# EAGLE design PWS (EAGLE 7.6.0)
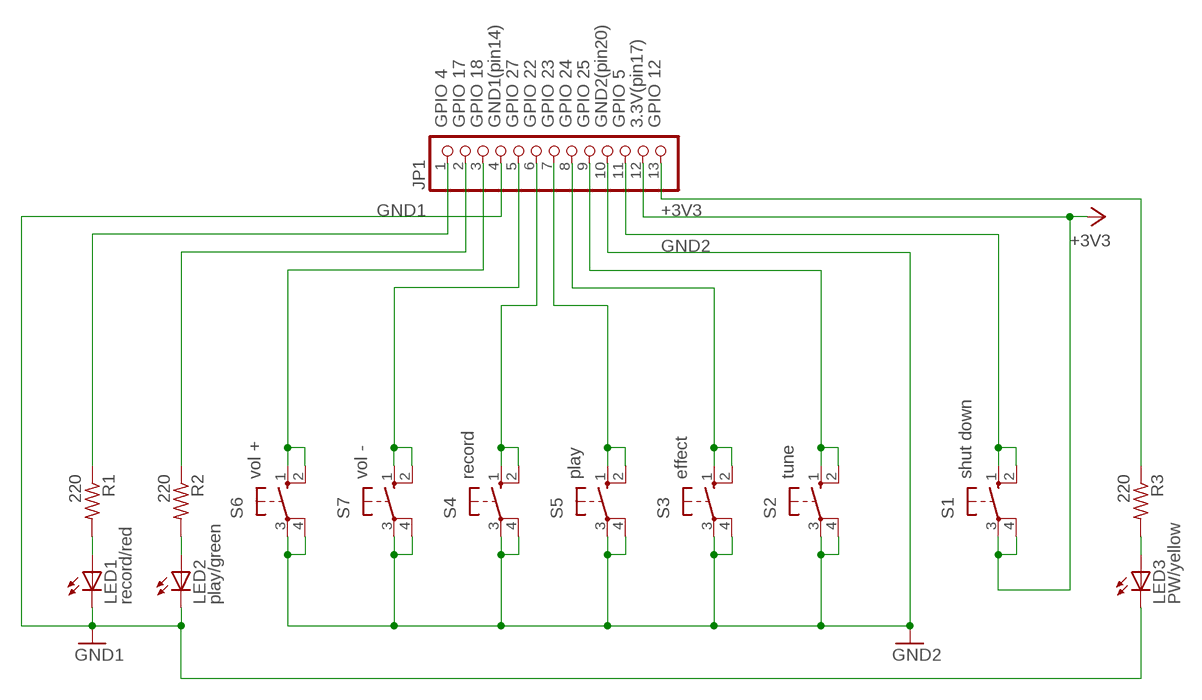
[diagram p0: schematic, sheet 1]

## Parts
JP1  PINHD-1X13  [1X13]
LED1  record/red  LED3MM  [LED3MM]
LED2  play/green  LED3MM  [LED3MM]
LED3  PW/yellow  LED3MM  [LED3MM]
R1  220  R-US_0204/5  [0204/5]
R2  220  R-US_0204/5  [0204/5]
R3  220  R-US_0204/5  [0204/5]
S1  shut down  10-XX  [B3F-10XX]
S2  tune  10-XX  [B3F-10XX]
S3  effect  10-XX  [B3F-10XX]
S4  record  10-XX  [B3F-10XX]
S5  play  10-XX  [B3F-10XX]
S6  vol +  10-XX  [B3F-10XX]
S7  vol -  10-XX  [B3F-10XX]

## Nets
+3V3: JP1.12 S1.3(P) S1.4(P1)
GND1: JP1.4 LED1.K(C) LED2.K(C) LED3.K(C)
GND2: JP1.10 S2.3(P) S2.4(P1) S3.3(P) S3.4(P1) S4.3(P) S4.4(P1) S5.3(P) S5.4(P1) S6.3(P) S6.4(P1) S7.3(P) S7.4(P1)
N$1: LED1.A R1.2
N$2: LED2.A R2.2
N$3: LED3.A R3.2
N$4: JP1.5 S7.1(S) S7.2(S1)
N$6: JP1.3 S6.1(S) S6.2(S1)
N$8: JP1.8 S3.1(S) S3.2(S1)
N$9: JP1.7 S5.1(S) S5.2(S1)
N$10: JP1.9 S2.1(S) S2.2(S1)
N$12: JP1.11 S1.1(S) S1.2(S1)
N$14: JP1.13 R3.1
N$15: JP1.6 S4.1(S) S4.2(S1)
N$16: JP1.2 R2.1
N$17: JP1.1 R1.1

## Notes on the sheet
- GPIO 4 | GPIO 17 | GPIO 18 | GND1(pin14) | GPIO 27 | GPIO 22 | GPIO 23 | GPIO 24 | GPIO 25 | GND2(pin20) | GPIO 5 | 3.3V(pin17) | GPIO 12

## Library data of the parts
JP1 = pinhead:PINHD-1X13: PIN HEADER
LED1-LED3 = led:LED: LED OSRAM: - CHIPLED LG R971, LG N971, LY N971, LG Q971, LY Q971, LO R971, LY R971 LH N974, LH R974 LS Q976, LO Q976, LY Q976 LO Q996 - Hyper CHIPLED LW Q18S LB Q993, LB Q99A, LB R99A - SideLED LS A670, LO A670, LY A670, LG A670, LP A670 LB A673, LV A673, LT A673, LW A673 LH A674 LY A675 LS A676, LA A676, LO A676, LY A676, LW A676 LS A679, LY A679, LG A679 - Hyper Micro SIDELED® LS Y876, LA Y876, LO Y876, LY Y876 LT Y87S - SmartLED LW L88C, LW L88S LB L89C, LB L89S, LG L890 LS L89K, LO L89K, LY L89K LS L896, LA L896, LO L896, LY L896 - TOPLED LS T670, LO T670, LY T670, LG T670, LP T670 LSG T670, LSP T670, LSY T670, LOP T670, LYG T670 LG T671, LOG T671, LSG T671 LB T673, LV T673, LT T673, LW T673 LH T674 LS T676, LA T676, LO T676, LY T676, LB T676, LH T676, LSB T676, LW T676 LB T67C, LV T67C, LT T67C, LS T67K, LO T67K, LY T67K, LW E67C LS E67B, LA E67B, LO E67B, LY E67B, LB E67C, LV E67C, LT E67C LW T67C LS T679, LY T679, LG T679 LS T770, LO T770, LY T770, LG T770, LP T770 LB T773, LV T773, LT T773, LW T773 LH T774 LS E675, LA E675, LY E675, LS T675 LS T776, LA T776, LO T776, LY T776, LB T776 LHGB T686 LT T68C, LB T68C - Hyper Mini TOPLED® LB M676 - Mini TOPLED Santana® LG M470 LS M47K, LO M47K, LY M47K Source: http://www.osram.convergy.de LUXEON: - LUMILED® LXK2-PW12-R00, LXK2-PW12-S00, LXK2-PW14-U00, LXK2-PW14-V00 LXK2-PM12-R00, LXK2-PM12-S00, LXK2-PM14-U00 LXK2-PE12-Q00, LXK2-PE12-R00, LXK2-PE12-S00, LXK2-PE14-T00, LXK2-PE14-U00 LXK2-PB12-K00, LXK2-PB12-L00, LXK2-PB12-M00, LXK2-PB14-N00, LXK2-PB14-P00, LXK2-PB14-Q00 LXK2-PR12-L00, LXK2-PR12-M00, LXK2-PR14-Q00, LXK2-PR14-R00 LXK2-PD12-Q00, LXK2-PD12-R00, LXK2-PD12-S00 LXK2-PH12-R00, LXK2-PH12-S00 LXK2-PL12-P00, LXK2-PL12-Q00, LXK2-PL12-R00 Source: www.luxeon.com KINGBRIGHT: KA-3528ASYC Source: www.kingbright.com
R1-R3 = resistor:R-US_: RESISTOR, American symbol
S1-S7 = switch-omron:10-XX: OMRON SWITCH; MPN: B3F-1000; OC_FARNELL: 176432; OC_NEWARK: 36M3542

## Board
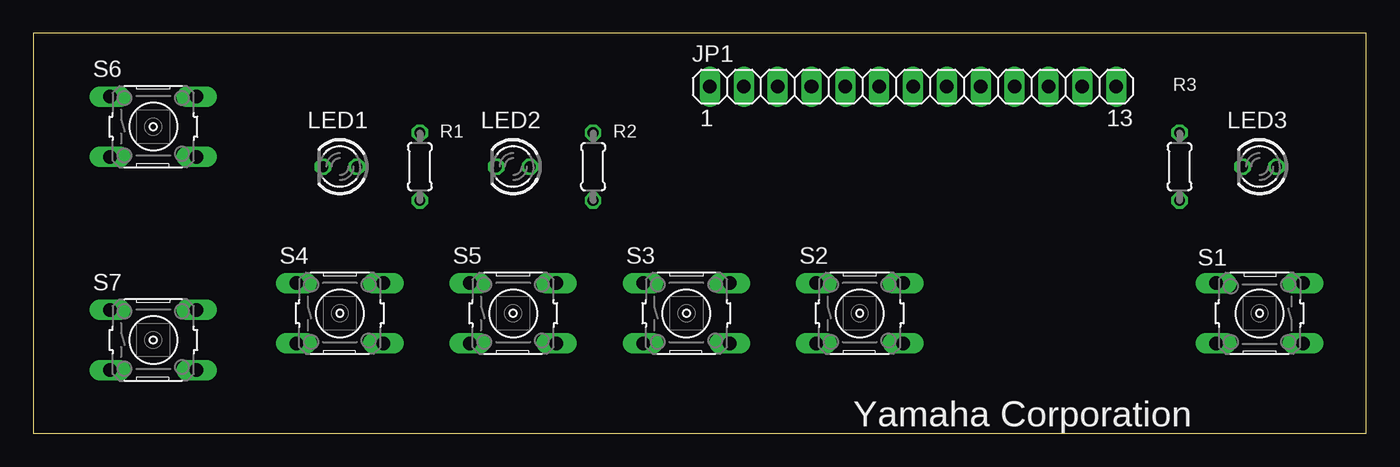
[diagram p1: board, top side]
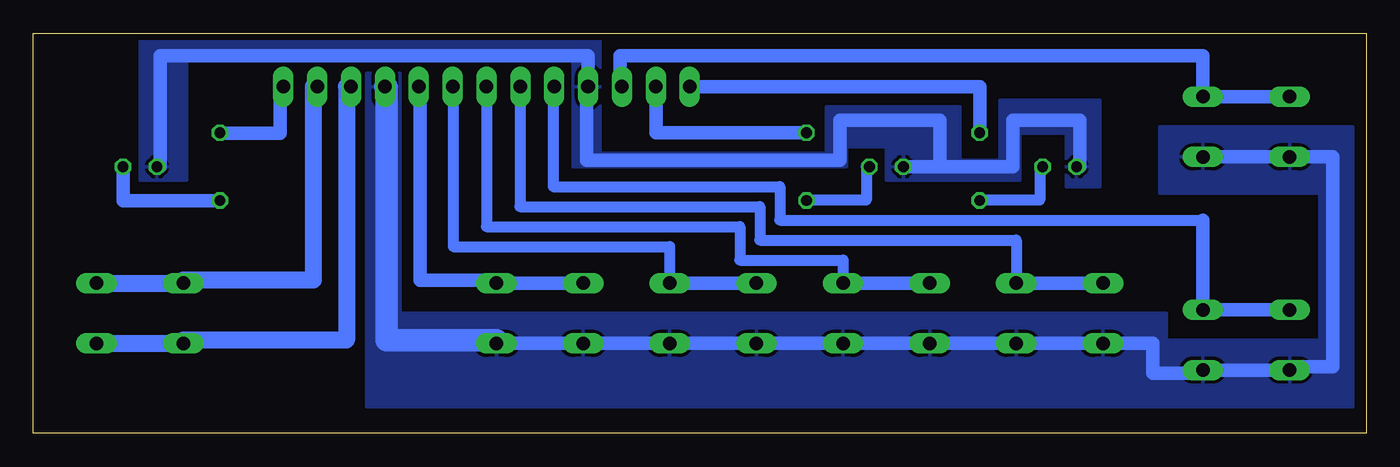
[diagram p2: board, bottom side, seen from below]

Size 100 x 30 mm. Coordinates in mm from the lower left corner, seen from the top.
Outline: 0,0 100,0 100,30 0,30 0,0
Copper layers (1*16): Top 0.035mm / dielectric 1.53mm / Bottom 0.035mm
Design rules "pban_5mil-l2": minimum track width 5mil, minimum drill 0.3mm, track to track 5mil, track to pad 0.229mm, pad to pad 5mil, via to via 5mil, smd to smd 5mil, copper to edge 0.5mm, drill to drill 0.5mm, minimum pad ring 0.15mm, minimum via ring 0.15mm, stop-mask expansion 4mil, vias tented up to drill 0.35mm, thermal gap 10mil

### Footprints (pad centres in the part's own frame; a part is rotated, then mirrored left to right if it is on the bottom)
1X13 = drill 1.016 long: 1 -15.24,0; 2 -12.7,0; 3 -10.16,0; 4 -7.62,0; 5 -5.08,0; 6 -2.54,0; 7 0,0; 8 2.54,0; 9 5.08,0; 10 7.62,0; 11 10.16,0; 12 12.7,0; 13 15.24,0
LED3MM = drill 0.813 octagon: A -1.27,0; K 1.27,0
0204/5 = drill 0.813 octagon: 1 -2.54,0; 2 2.54,0
B3F-10XX = drill 1.016 long: 1 -3.251,2.261; 2 3.251,2.261; 3 -3.251,-2.261; 4 3.251,-2.261

### Placement (x,y rotation side)
JP1  66,26 0 top
LED1  23,20 180 top
LED2  36,20 180 top
LED3  92,20 180 top
R1  29,20 270 top
R2  42,20 270 top
R3  86,20 270 top
S1  92,9 180 top
S2  62,9 0 top
S3  49,9 0 top
S4  23,9 0 top
S5  36,9 0 top
S6  9,23 0 top
S7  9,7 0 top

### Tracks (layer width: path | path; a pad name or v marks a point on that pad's centre or on a via)
+3V3
  Bottom 0.813: JP1.12 79,26 | 88.75,11.5 S1.4
  Bottom 1.27: 79,26 79,11.5 88.75,11.5 | S1.3 S1.4
GND1
  Bottom 0.813: JP1.4 58.5,26 | LED1.K 21.5,20 | LED3.K 90.5,20
  Bottom 1.016: 58.5,26 58.5,20.5 39.5,20.5 39.5,23.5 32,23.5 32,20 | 32,20 LED2.K | 21.5,20 21.5,23.5 26.5,23.5 26.5,20 32,20 | 90.5,20 90.5,28.3 58.38,28.3 JP1.4
  pour Bottom: 57.5,28.5 57.5,21 40.5,21 40.5,24.5 30.5,24.5 30.5,20.5 27.5,20.5 27.5,25 20,25 20,18.5 22.5,18.5 22.5,19 22.5,22.5 26,22.5 26,19 35.5,19 36,19 36,21 36,21.5 38.5,21.5 39,21.5 39,20 59.5,20 59.5,28 88.5,28 88.5,19 92,19 92,29.5 57.5,29.5
GND2
  Bottom 0.813: 65.25,7 S2.4 | 12.25,4.5 S7.4 | 5.75,5 S7.3
  Bottom 1.016: S2.4 S2.3 S3.4 S3.3 S5.4 S5.3 S4.4 S4.3 16,6.74 16,4.5 12.25,4.5 | S7.4 S7.3 | 5.75,5 2.5,5 2.5,20.74 S6.3 S6.4
  Bottom 1.676: JP1.10 73.5,26 73.5,7 65.25,7
  pour Bottom: 75,27 75,2 1,2 1,23 15.5,23 15.5,18 3.5,18 3.5,7 15,7 15,9 72.5,9 72.5,27
N$1
  Bottom 0.813: LED1.A 24.5,20 24.5,17.5 29,17.5 R1.2
N$2
  Bottom 0.813: LED2.A 37.5,20 37.5,17.5 42,17.5 R2.2
N$3
  Bottom 1.016: R3.2 93.27,17.46 LED3.A
N$4
  Bottom 0.813: JP1.5 61,26 61,18.5 44,18.5 44,16 12.25,16
  Bottom 1.016: 12.25,16 S7.2 S7.1
N$6
  Bottom 0.813: JP1.3 56,26
  Bottom 1.016: 56,26 56,28.3 12.25,28.3 S6.2 S6.1
N$8
  Bottom 0.813: JP1.8 68.5,26 68.5,14 52.25,14 S3.2
  Bottom 1.016: S3.1 S3.2
N$9
  Bottom 0.813: JP1.7 66,15.5 47,15.5 47,13 39.25,13 S5.2
  Bottom 1.016: S5.1 S5.2
N$10
  Bottom 0.813: JP1.9 71,26 | 65.25,11.5 S2.2
  Bottom 1.016: 71,26 71,11.5 65.25,11.5 | S2.1 S2.2
N$12
  Bottom 0.813: JP1.11 76.5,26 | 88.75,7 S1.2
  Bottom 1.27: 76.5,26 76.5,7 88.75,7 | S1.1 S1.2
N$14
  Bottom 0.813: JP1.13 81.5,26 | 86,22.5 R3.1
  Bottom 1.016: 81.5,26 81.5,22.5 86,22.5
N$15
  Bottom 0.813: JP1.6 63.5,26 63.5,17 45.5,17 45.5,14.5 26.25,14.5 S4.2
  Bottom 1.016: S4.1 S4.2
N$16
  Bottom 1.016: R2.1 53.3,22.54 JP1.2
N$17
  Bottom 0.813: R1.1 29,22.5
  Bottom 1.016: R1.1 29,26 JP1.1

### Text on the board
tNames: 1 | 13 | Yamaha Corporation